# EAGLE design xspi_v4 (EAGLE 7.3.0)
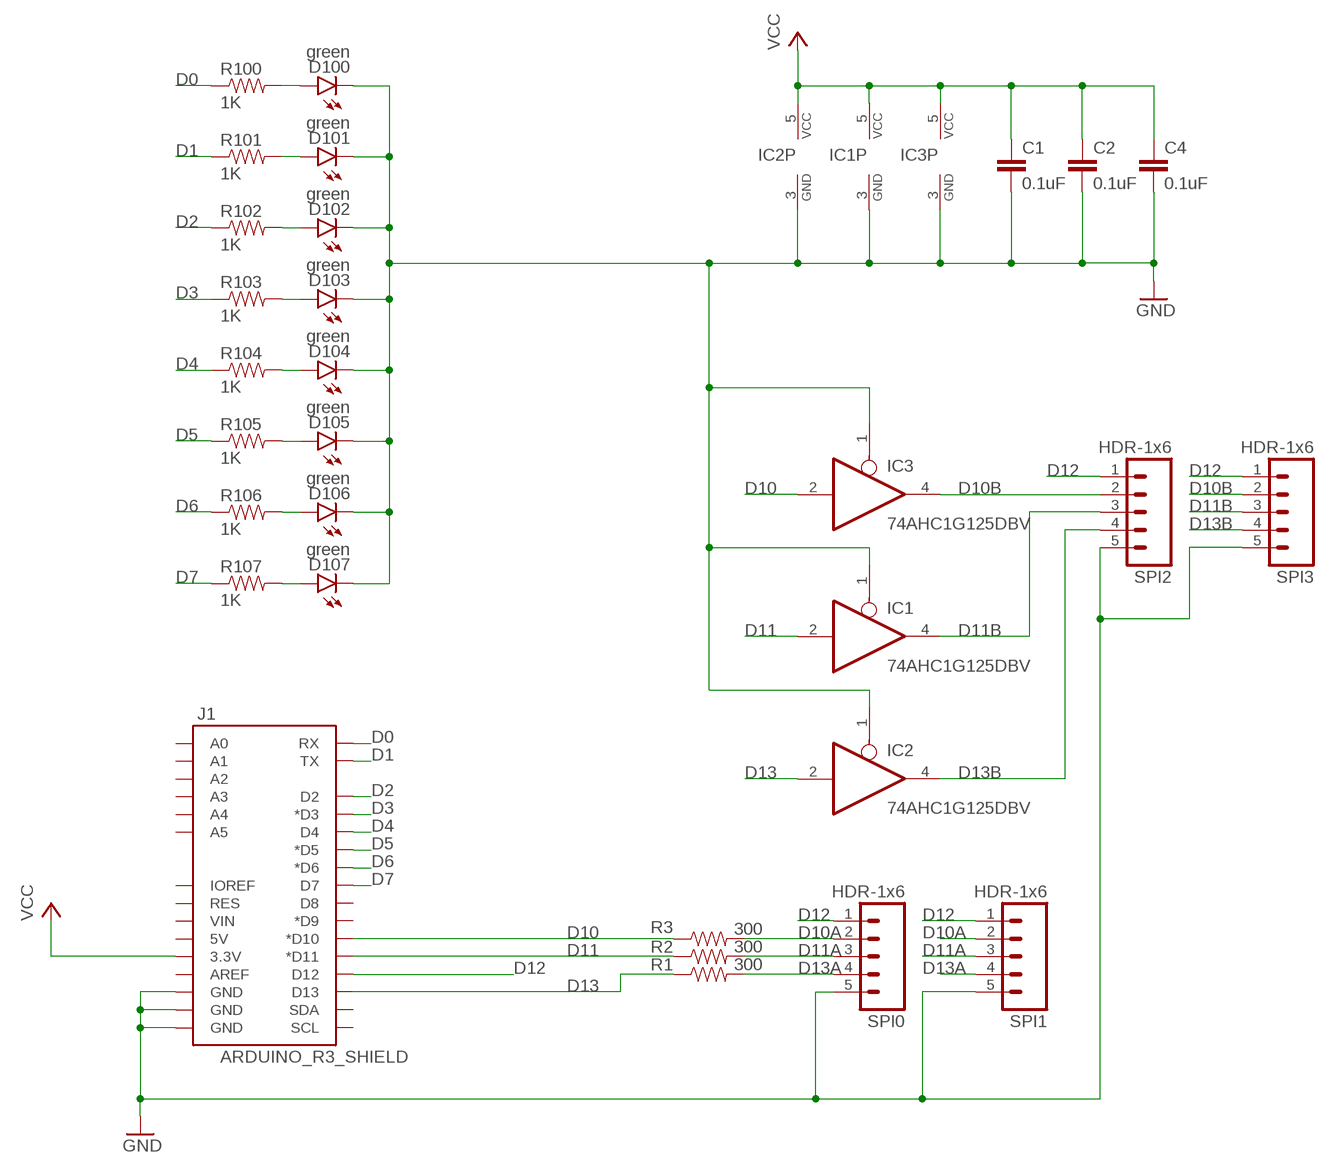
[diagram p0: schematic, sheet 1]

## Parts
C1  0.1uF  1.0UF-25V-+80/-20(0805)"  [0805-CAP]
C2  0.1uF  1.0UF-25V-+80/-20(0805)"  [0805-CAP]
C4  0.1uF  1.0UF-25V-+80/-20(0805)"  [0805-CAP]
D100  green  LED-FKIT-1206  [FKIT-LED-1206]
D101  green  LED-FKIT-1206  [FKIT-LED-1206]
D102  green  LED-FKIT-1206  [FKIT-LED-1206]
D103  green  LED-FKIT-1206  [FKIT-LED-1206]
D104  green  LED-FKIT-1206  [FKIT-LED-1206]
D105  green  LED-FKIT-1206  [FKIT-LED-1206]
D106  green  LED-FKIT-1206  [FKIT-LED-1206]
D107  green  LED-FKIT-1206  [FKIT-LED-1206]
IC1  74AHC1G125DBV  [SOT23-5]
IC2  74AHC1G125DBV  [SOT23-5]
IC3  74AHC1G125DBV  [SOT23-5]
J1  ARDUINO_R3_SHIELD  [UNO_R3_SHIELD]
R1  300  RESISTORPTH-1/4W  [AXIAL-0.4]
R2  300  RESISTORPTH-1/4W  [AXIAL-0.4]
R3  300  RESISTORPTH-1/4W  [AXIAL-0.4]
R100  1K  RESISTOR0805-RES  [0805]
R101  1K  RESISTOR0805-RES  [0805]
R102  1K  RESISTOR0805-RES  [0805]
R103  1K  RESISTOR0805-RES  [0805]
R104  1K  RESISTOR0805-RES  [0805]
R105  1K  RESISTOR0805-RES  [0805]
R106  1K  RESISTOR0805-RES  [0805]
R107  1K  RESISTOR0805-RES  [0805]
SPI0  HDR-1x6  M05PTH_LONGPADS  [1X05_LONGPADS]
SPI1  HDR-1x6  M05PTH_LONGPADS  [1X05_LONGPADS]
SPI2  HDR-1x6  M05PTH_LONGPADS  [1X05_LONGPADS]
SPI3  HDR-1x6  M05PTH_LONGPADS  [1X05_LONGPADS]

## Nets
D0: J1.RX R100.1
D1: J1.TX R101.1
D2: J1.D2 R102.1
D3: J1.D3(*D3) R103.1
D4: J1.D4 R104.1
D5: J1.D5(*D5) R105.1
D6: J1.D6(*D6) R106.1
D7: J1.D7 R107.1
D10: IC3.2(I) J1.D10(*D10) R3.P$1
D10A: R3.P$2 SPI0.2 SPI1.2
D10B: IC3.4(O) SPI2.2 SPI3.2
D11: IC1.2(I) J1.D11(*D11) R2.P$1
D11A: R2.P$2 SPI0.3 SPI1.3
D11B: IC1.4(O) SPI2.3 SPI3.3
D12: J1.D12 SPI0.1 SPI1.1 SPI2.1 SPI3.1
D13: IC2.2(I) J1.D13 R1.P$1
D13A: R1.P$2 SPI0.4 SPI1.4
D13B: IC2.4(O) SPI2.4 SPI3.4
GND: C1.2 C2.2 C4.2 D100.C D101.C D102.C D103.C D104.C D105.C D106.C D107.C IC1.1(OE) IC1.3(GND) IC2.1(OE) IC2.3(GND) IC3.1(OE) IC3.3(GND) J1.GND@0(GND) J1.GND@1(GND) J1.GND@2(GND) SPI0.5 SPI1.5 SPI2.5 SPI3.5
N$1: D107.A R107.2
N$8: D106.A R106.2
N$9: D105.A R105.2
N$10: D104.A R104.2
N$11: D103.A R103.2
N$12: D102.A R102.2
N$13: D100.A R100.2
N$14: D101.A R101.2
VCC: C1.1 C2.1 C4.1 IC1.5(VCC) IC2.5(VCC) IC3.5(VCC) J1.3.3V
Unconnected: J1.5V J1.A0 J1.A1 J1.A2 J1.A3 J1.A4 J1.A5 J1.AREF J1.D8 J1.D9(*D9) J1.IOREF J1.RES J1.SCL J1.SDA J1.VIN

## Library data of the parts
C1 C2 C4 = SparkFun-Capacitors:1.0UF-25V-+80/-20(0805): CAP-11625; PROD_ID: 0805; VALUE: 1.0uF
D100-D107 = SparkFun-LED:LED: LEDs Standard schematic elements and footprints for 5mm, 3mm, 1206, and 0603 sized LEDs. 5mm - Spark Fun Electronics SKU : COM-00529 (and others)
IC1-IC3 = 74xx-little-us:74*1G125: Single Bus Buffer Gate with 3-State Output
J1 = SparkFun-Boards:ARDUINO_R3_SHIELD: Shield form compatible with the Arduino Uno R3.
R1-R3 R100-R107 = SparkFun-Passives:RESISTOR: Resistor Basic schematic elements and footprints for 0603, 1206, and PTH resistors.
SPI0 SPI1-SPI3 = SparkFun-Connectors:M05: Header 5 Standard 5-pin 0.1" header. Use with straight break away headers (SKU : PRT-00116), right angle break away headers (PRT-00553), swiss pins (PRT-00743), machine pins (PRT-00117), and female headers (PRT-00115). Molex polarized connector foot print use with SKU : PRT-08230 with associated crimp pins and housings.

## Board
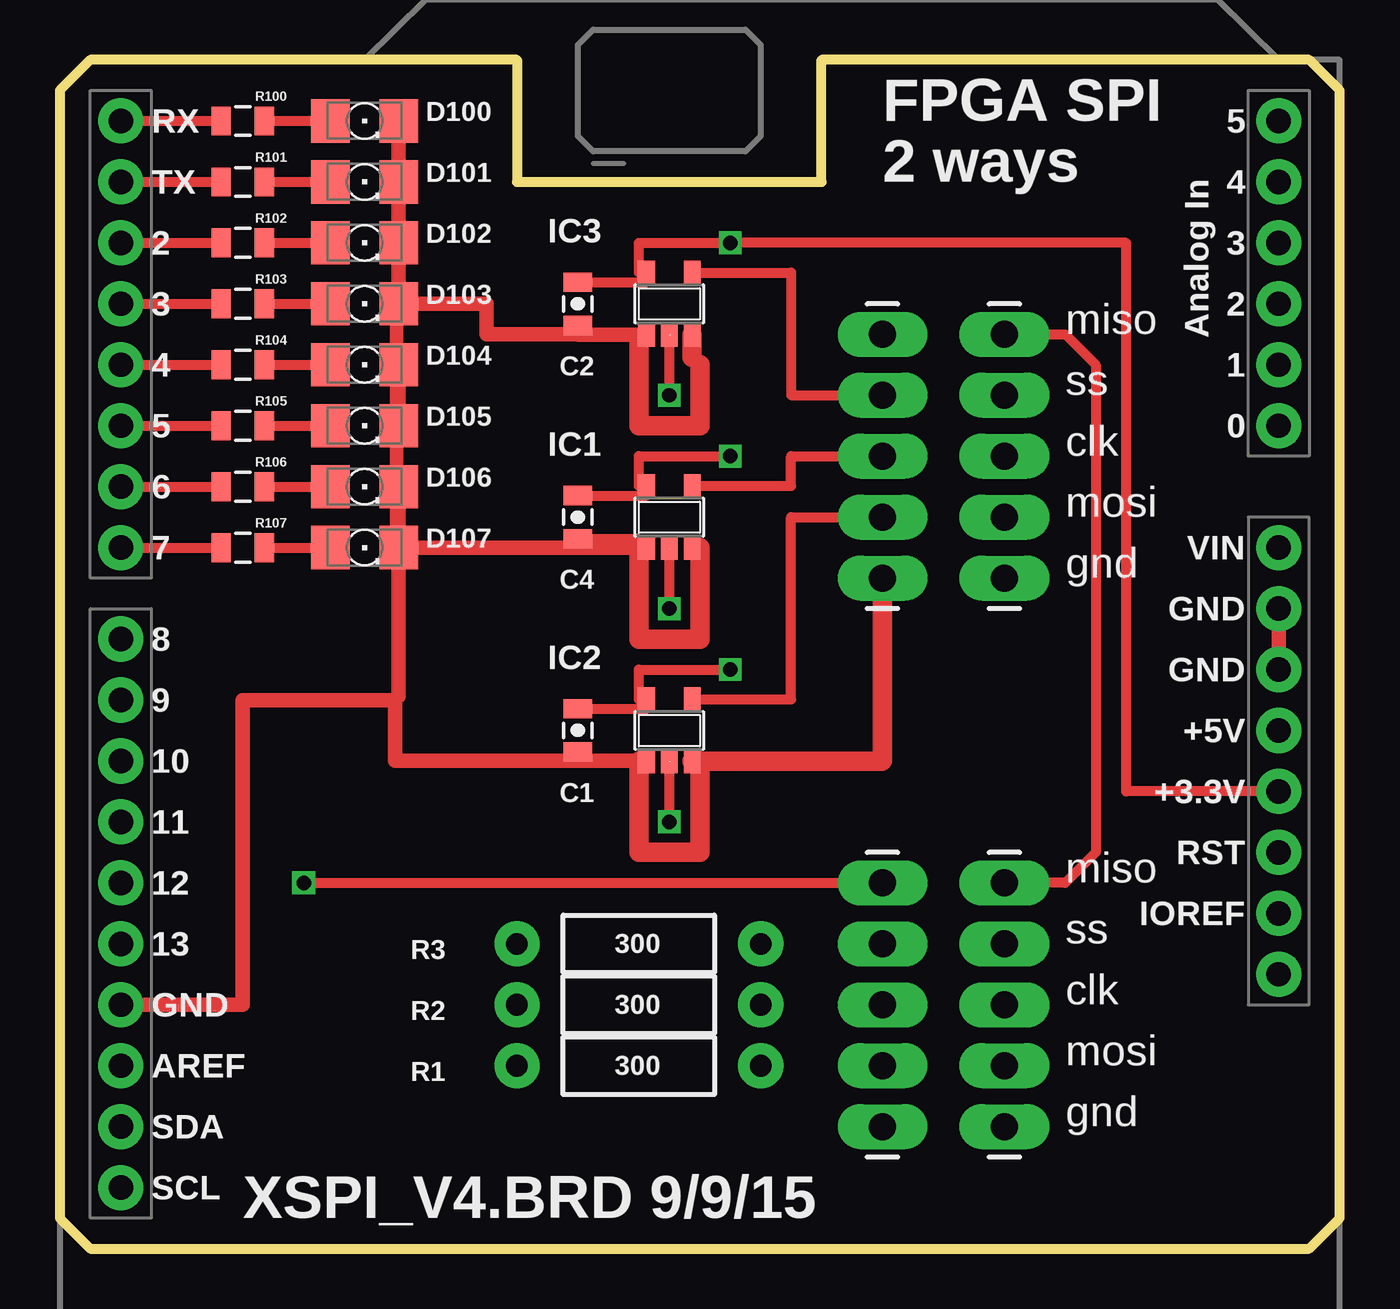
[diagram p1: board, top side]
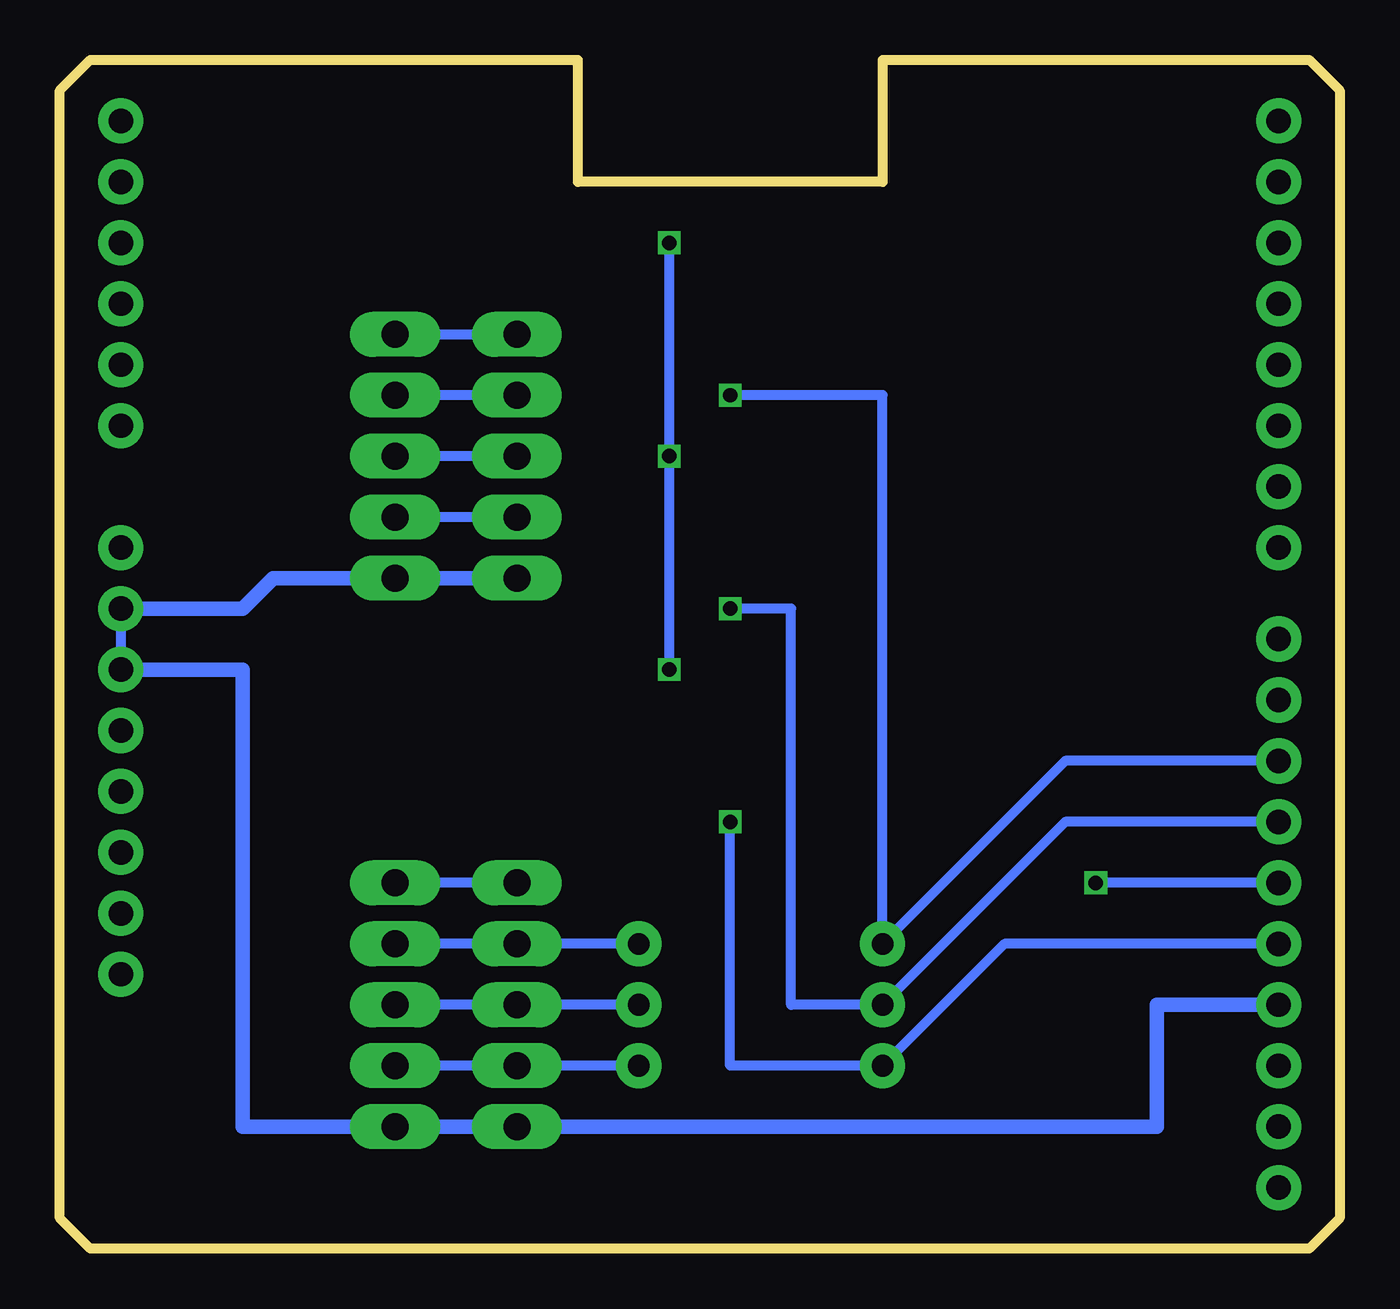
[diagram p2: board, bottom side, seen from below]

Size 53.34 x 49.53 mm. Coordinates in mm from the lower left corner, seen from the top.
Outline: 19.05,49.53 19.05,44.45 31.75,44.45 31.75,49.53 52.07,49.53 53.34,48.26 53.34,1.27 52.07,0 1.27,0 0,1.27 0,48.26 1.27,49.53 19.05,49.53
Copper layers (1*16): Top 0.0356mm / dielectric 1.5011mm / Bottom 0.0356mm
Design rules "oshpark-2layer *": minimum track width 6mil, minimum drill 15mil, track to track 6mil, track to pad 6mil, pad to pad 6mil, via to via 6mil, smd to smd 6mil, copper to edge 15mil, drill to drill 6mil, minimum pad ring 7mil, minimum via ring 7mil, stop-mask expansion 4mil, vias tented up to drill 0mil, thermal gap 10mil

### Footprints (pad centres in the part's own frame; a part is rotated, then mirrored left to right if it is on the bottom)
0805-CAP = smd 0.8 x 1.2: 1 -0.9,0; 2 0.9,0
FKIT-LED-1206 = smd 1.6 x 1.803: A -1.422,0; C 1.422,0
SOT23-5 = smd 0.69 x 0.99: 1 -0.95,-1.29; 2 0,-1.29; 3 0.95,-1.29; 4 0.95,1.3; 5 -0.95,1.3
UNO_R3_SHIELD = drill 1.016 pad 1.88: 3.3V 50.8,26.67; 5V 50.8,29.21; A0 50.8,41.91; A1 50.8,44.45; A2 50.8,46.99; A3 50.8,49.53; A4 50.8,52.07; A5 50.8,54.61; AREF 2.54,15.24; D2 2.54,49.53; D3 2.54,46.99; D4 2.54,44.45; D5 2.54,41.91; D6 2.54,39.37; D7 2.54,36.83; D8 2.54,33.02; D9 2.54,30.48; D10 2.54,27.94; D11 2.54,25.4; D12 2.54,22.86; D13 2.54,20.32; GND@0 50.8,31.75; GND@1 50.8,34.29; GND@2 2.54,17.78; IOREF 50.8,21.59; NC 50.8,19.05; RES 50.8,24.13; RX 2.54,54.61; SCL 2.54,10.16; SDA 2.54,12.7; TX 2.54,52.07; VIN 50.8,36.83
AXIAL-0.4 = drill 0.9 pad 1.88: P$1 -5.08,0; P$2 5.08,0
0805 = smd 0.8 x 1.2: 1 -0.9,0; 2 0.9,0
1X05_LONGPADS = drill 1.118 pad 1.88 long: 1 0,0; 2 2.54,0; 3 5.08,0; 4 7.62,0; 5 10.16,0

### Placement (x,y rotation side)
C1  21.59,21.59 270 top
C2  21.59,39.37 270 top
C4  21.59,30.48 270 top
D100  12.7,46.99 0 top
D101  12.7,44.45 0 top
D102  12.7,41.91 0 top
D103  12.7,39.37 0 top
D104  12.7,36.83 0 top
D105  12.7,34.29 0 top
D106  12.7,31.75 0 top
D107  12.7,29.21 0 top
IC1  25.4,30.48 0 top
IC2  25.4,21.59 0 top
IC3  25.4,39.37 0 top
J1  0,-7.62 0 top
R1  24.13,7.62 0 top
R2  24.13,10.16 0 top
R3  24.13,12.7 0 top
R100  7.62,46.99 0 top
R101  7.62,44.45 0 top
R102  7.62,41.91 0 top
R103  7.62,39.37 0 top
R104  7.62,36.83 0 top
R105  7.62,34.29 0 top
R106  7.62,31.75 0 top
R107  7.62,29.21 0 top
SPI0  34.29,15.24 270 top
SPI1  39.37,15.24 270 top
SPI2  34.29,38.1 270 top
SPI3  39.37,38.1 270 top

### Tracks (layer width: path | path; a pad name or v marks a point on that pad's centre or on a via)
D0
  Top 0.406: J1.RX R100.1
D1
  Top 0.406: J1.TX R101.1
D2
  Top 0.406: J1.D2 R102.1
D3
  Top 0.406: J1.D3 R103.1
D4
  Top 0.406: J1.D4 R104.1
D5
  Top 0.406: J1.D5 R105.1
D6
  Top 0.406: J1.D6 R106.1
D7
  Top 0.406: J1.D7 R107.1
D10  (via drill 0.6)
  Top 0.406: v25.4,35.56 IC3.2
  Bottom 0.406: J1.D10 11.43,20.32 R3.P$1 19.05,35.56 v25.4,35.56
D10A
  Bottom 0.406: R3.P$2 SPI0.2 SPI1.2
D10B
  Top 0.406: IC3.4 30.48,40.67 30.48,35.56 SPI2.2
  Bottom 0.406: SPI2.2 SPI3.2
D11  (via drill 0.6)
  Top 0.406: v25.4,26.67 IC1.2
  Bottom 0.406: J1.D11 11.43,17.78 R2.P$1 22.86,10.16 22.86,26.67 v25.4,26.67
D11A
  Bottom 0.406: R2.P$2 SPI0.3 SPI1.3
D11B
  Top 0.406: IC1.4 30.48,31.78 30.48,33.02 SPI2.3
  Bottom 0.406: SPI2.3 SPI3.3
D12  (via drill 0.6)
  Top 0.406: SPI3.1 41.91,38.1 43.18,36.83 43.18,16.51 41.91,15.24 SPI1.1 | v10.16,15.24 SPI0.1
  Bottom 0.406: SPI0.1 SPI1.1 | SPI3.1 SPI2.1 | J1.D12 v10.16,15.24
D13  (via drill 0.6)
  Top 0.406: v25.4,17.78 IC2.2
  Bottom 0.406: J1.D13 13.97,12.7 R1.P$1 25.4,7.62 v25.4,17.78
D13A
  Bottom 0.406: R1.P$2 SPI0.4 SPI1.4
D13B
  Top 0.406: IC2.4 30.48,22.89 30.48,30.48 SPI2.4
  Bottom 0.406: SPI2.4 SPI3.4
GND
  Top 0.406: C4.2 24.06,29.58 | 24.06,29.58 IC1.1 24.13,29.19 24.13,29.21 | IC2.1 24.13,20.3 24.13,20.32 | D106.C D105.C | D104.C D103.C 13.97,39.37 13.97,29.21 | 13.97,22.86 14.12,23.01 | 24.06,29.58 24.06,29.21 D107.C | IC2.3 26.35,20.32 26.67,20.32 | IC1.3 26.35,29.21 26.67,29.21 | 34.29,20.32 arc-90 34.27,20.3 | 24.13,37.76 arc-90 IC3.1 21.98,38.08 arc-90 C2.2 arc90 21.96,38.1 22.86,38.1 | 26.67,36.83 arc-90 26.35,37.15 | C1.2 21.59,20.32 | 21.59,38.1 arc90 21.61,38.08
  Top 0.61: D100.C D101.C D102.C D103.C 17.78,39.37 17.78,38.1 21.59,38.1 | D106.C D107.C 14.12,23.01 | D105.C D104.C | J1.GND@2 7.62,10.16 7.62,22.86 13.97,22.86 13.97,20.32 21.59,20.32 24.13,20.32 | 24.13,29.21 13.97,29.21 | J1.GND@1 J1.GND@0 | 21.61,38.08 IC3.1
  Top 0.813: 24.13,20.3 24.13,16.51 26.67,16.51 26.67,20.32 | 24.13,29.19 24.13,25.4 26.67,25.4 26.67,29.21 | SPI2.5 34.29,20.32 | 34.27,20.3 IC2.3 | 24.13,37.76 24.13,34.29 26.67,34.29 26.67,36.83 | 26.35,37.15 IC3.3
  Bottom 0.406: J1.GND@1 J1.GND@0
  Bottom 0.61: J1.GND@1 45.72,26.67 44.45,27.94 SPI3.5 SPI2.5 | J1.GND@0 45.72,24.13 45.72,5.08 SPI1.5 SPI0.5 7.62,5.08 7.62,10.16 J1.GND@2
N$1
  Top 0.406: R107.2 D107.A
N$8
  Top 0.406: R106.2 D106.A
N$9
  Top 0.406: R105.2 D105.A
N$10
  Top 0.406: R104.2 D104.A
N$11
  Top 0.406: R103.2 D103.A
N$12
  Top 0.406: R102.2 D102.A
N$13
  Top 0.406: R100.2 D100.A
N$14
  Top 0.406: R101.2 D101.A
VCC  (via drill 0.6)
  Top 0.406: C4.1 24.45,31.38 IC1.5 24.13,31.78 24.13,33.02 v27.94,33.02 | C2.1 24.45,40.27 IC3.5 24.13,40.67 24.13,41.91 v27.94,41.91 44.45,41.91 44.45,19.05 J1.3.3V | C1.1 24.45,22.49 IC2.5 24.13,22.89 24.13,24.13 v27.94,24.13
  Bottom 0.406: v27.94,24.13 v27.94,33.02 v27.94,41.91

### Text on the board
tPlace: FPGA SPI | 2 ways | XSPI_V4.BRD 9/9/15
tNames: miso | ss | clk | mosi | gnd | miso | ss | clk | mosi | gnd